# Altium schematic sheet 07 flash.SchDoc
size A3; SheetNumber: 11; SheetTotal: 16
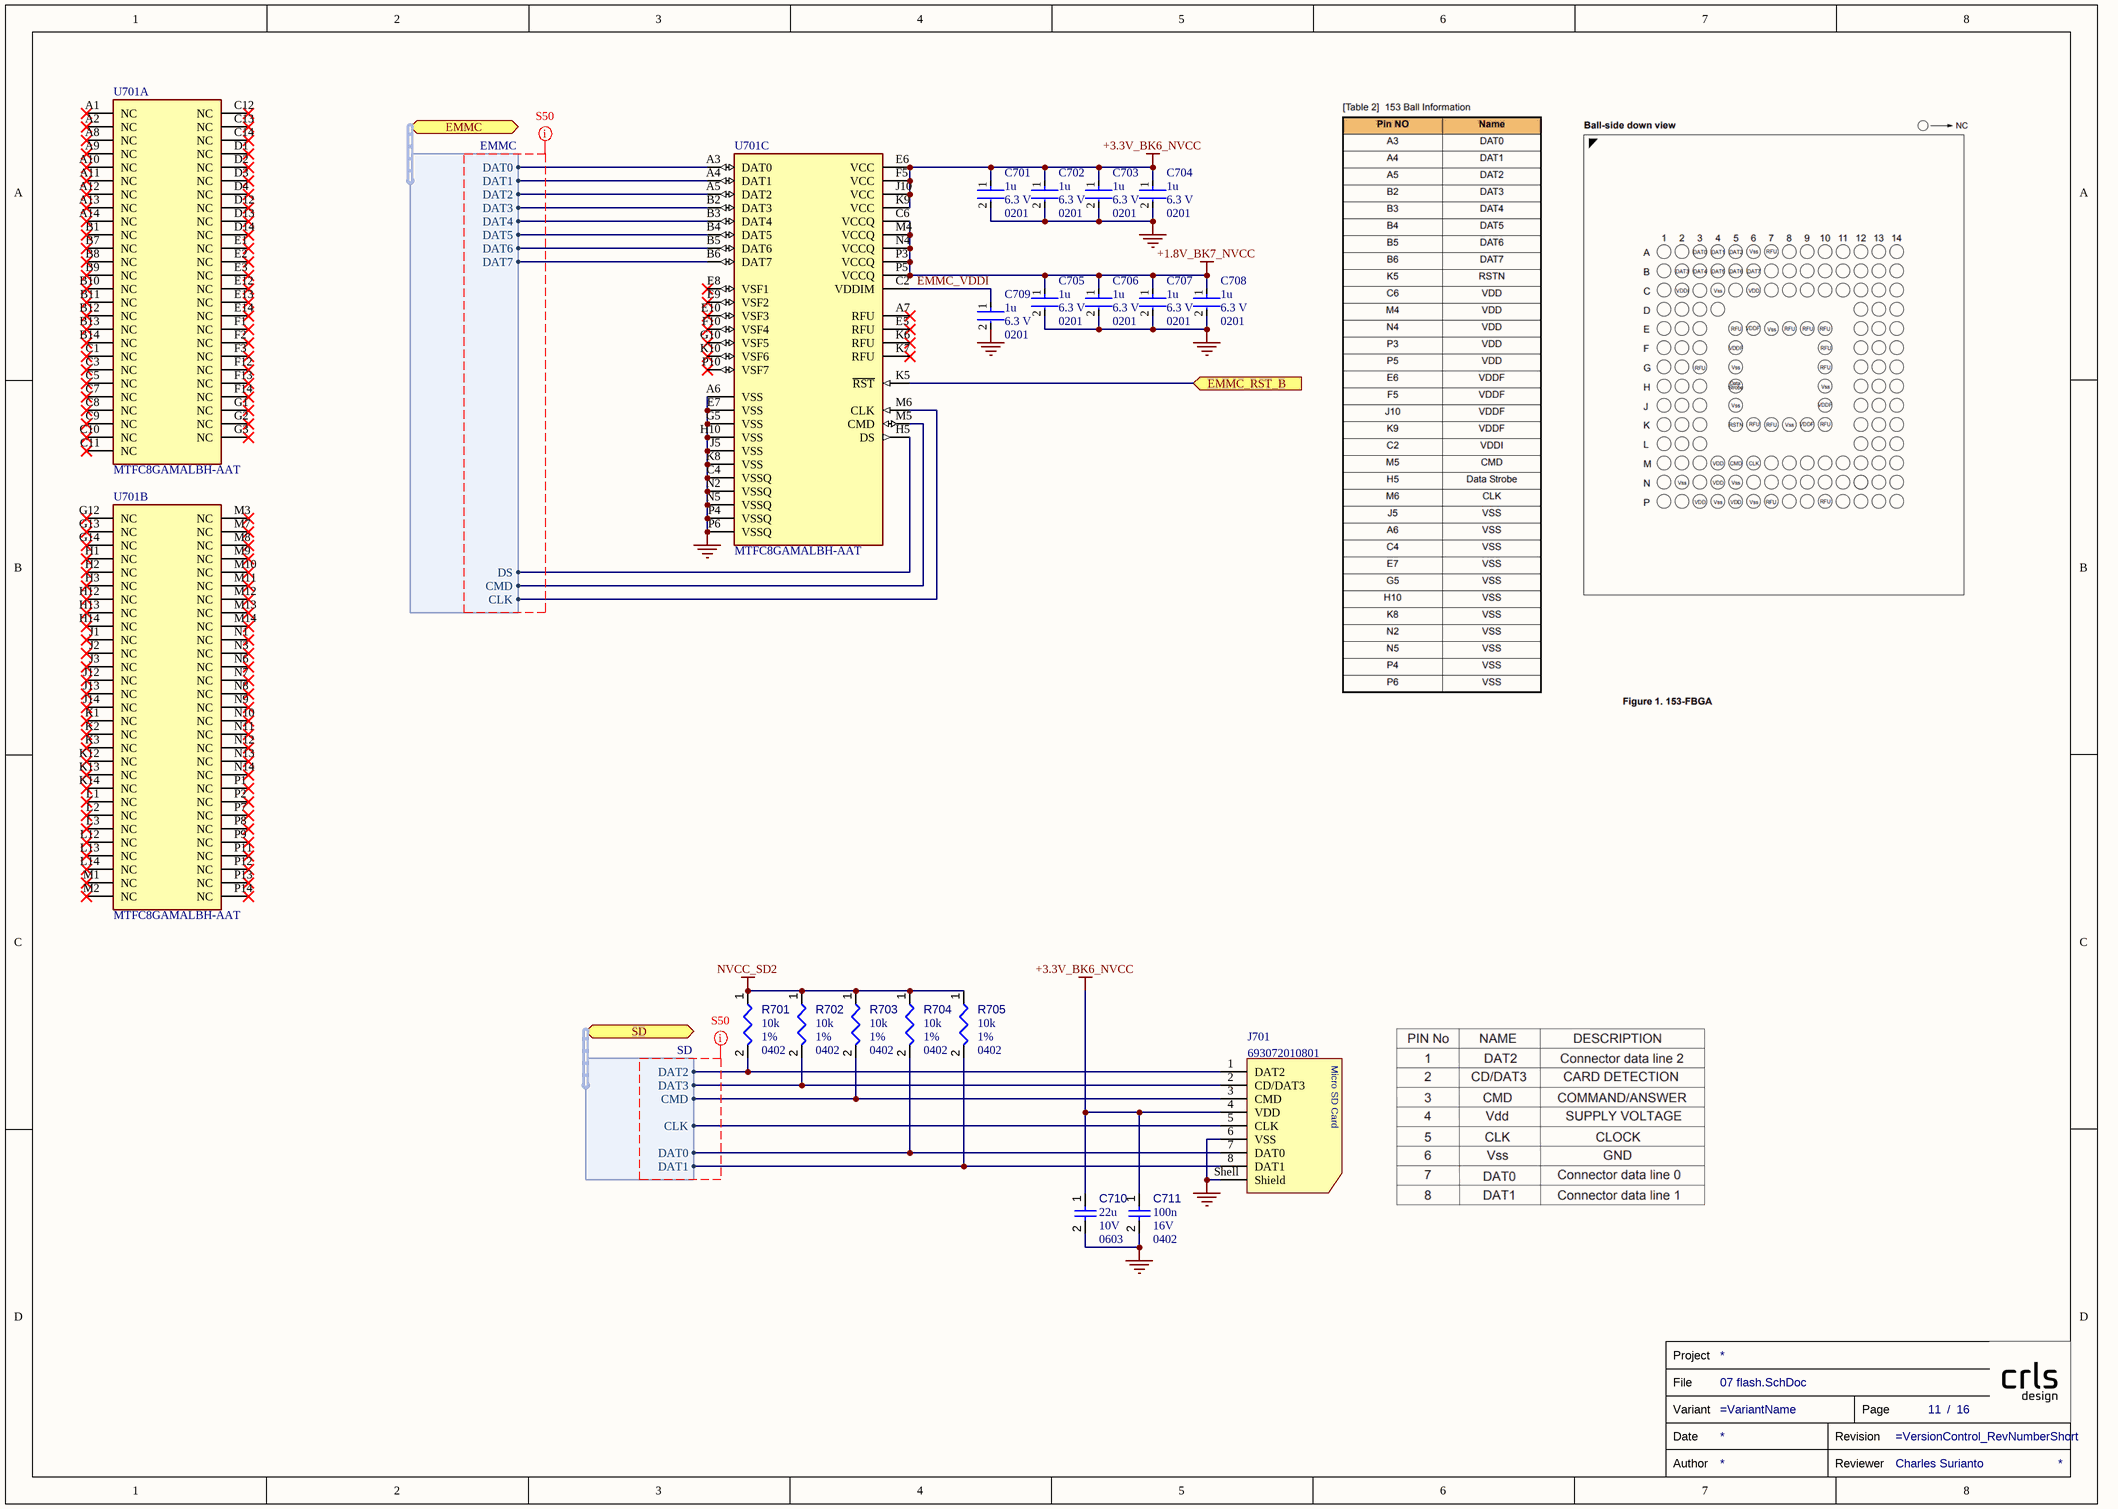
[diagram p0: 07 flash.SchDoc]

## Parts
C701  Package: 0201  Capacitance: 1u  Voltage Rating: 6.3 V  [FP-CC0201-BA-MFG]  (hidden comment: CC0201MRX5R5BB105)
C702  Package: 0201  Capacitance: 1u  Voltage Rating: 6.3 V  [FP-CC0201-BA-MFG]  (hidden comment: CC0201MRX5R5BB105)
C703  Package: 0201  Capacitance: 1u  Voltage Rating: 6.3 V  [FP-CC0201-BA-MFG]  (hidden comment: CC0201MRX5R5BB105)
C704  Package: 0201  Capacitance: 1u  Voltage Rating: 6.3 V  [FP-CC0201-BA-MFG]  (hidden comment: CC0201MRX5R5BB105)
C705  Package: 0201  Capacitance: 1u  Voltage Rating: 6.3 V  [FP-CC0201-BA-MFG]  (hidden comment: CC0201MRX5R5BB105)
C706  Package: 0201  Capacitance: 1u  Voltage Rating: 6.3 V  [FP-CC0201-BA-MFG]  (hidden comment: CC0201MRX5R5BB105)
C707  Package: 0201  Capacitance: 1u  Voltage Rating: 6.3 V  [FP-CC0201-BA-MFG]  (hidden comment: CC0201MRX5R5BB105)
C708  Package: 0201  Capacitance: 1u  Voltage Rating: 6.3 V  [FP-CC0201-BA-MFG]  (hidden comment: CC0201MRX5R5BB105)
C709  Package: 0201  Capacitance: 1u  Voltage Rating: 6.3 V  [FP-CC0201-BA-MFG]  (hidden comment: CC0201MRX5R5BB105)
C710  value 22u  Case/Package: 0603  Voltage Rating: 10V  [CAPC0603(1608)100_L]  (hidden comment: Capacitors,0603,22u,10V)
C711  value 100n  Case/Package: 0402  Voltage Rating: 16V  [CAPC0402(1005)60_L]  (hidden comment: Capacitors,0402,100n,16V)
J701  693072010801  [693072010801]
R701  value 10k  Case/Package: 0402  Tolerance: 1%  [RESC0402(1005)_L]  (hidden comment: Resistors,0402,1%,10k)
R702  value 10k  Case/Package: 0402  Tolerance: 1%  [RESC0402(1005)_L]  (hidden comment: Resistors,0402,1%,10k)
R703  value 10k  Case/Package: 0402  Tolerance: 1%  [RESC0402(1005)_L]  (hidden comment: Resistors,0402,1%,10k)
R704  value 10k  Case/Package: 0402  Tolerance: 1%  [RESC0402(1005)_L]  (hidden comment: Resistors,0402,1%,10k)
R705  value 10k  Case/Package: 0402  Tolerance: 1%  [RESC0402(1005)_L]  (hidden comment: Resistors,0402,1%,10k)
TB?  Reviewer: Charles Surianto  (hidden comment: TITLE_BLOCK)  (graphical)
U701  MTFC8GAMALBH-AAT  [FP-BH-MFG]  (parts A,B,C of 3)

## Ports
EMMC (bidir, harness EMMC), EMMC_RST_B (in), SD (bidir, harness SD)

## Harnesses
SD: DAT2, DAT3, CMD, DAT1, DAT0, CLK
EMMC: DAT1, DAT3, DAT2, DAT4, DAT0, DAT5, DAT6, DAT7, DS, CMD, CLK

## Nets
+1.8V_BK7_NVCC: C705.1 C706.1 C707.1 C708.1 U701.C6(VCCQ) U701.M4(VCCQ) U701.N4(VCCQ) U701.P3(VCCQ) U701.P5(VCCQ)
+3.3V_BK6_NVCC: C701.1 C702.1 C703.1 C704.1 C710.1 C711.1 J701.4(VDD) U701.E6(VCC) U701.F5(VCC) U701.J10(VCC) U701.K9(VCC)
GND: C701.2 C702.2 C703.2 C704.2 C705.2 C706.2 C707.2 C708.2 C709.2 C710.2 C711.2 J701.6(VSS) J701.Shell(Shield) U701.A6(VSS) U701.C4(VSSQ) U701.E7(VSS) U701.G5(VSS) U701.H10(VSS) U701.J5(VSS) U701.K8(VSS) U701.N2(VSSQ) U701.N5(VSSQ) U701.P4(VSSQ) U701.P6(VSSQ)
NVCC_SD2: R701.1 R702.1 R703.1 R704.1 R705.1
EMMC_RST_B: U701.K5(~{RST}) ; port EMMC_RST_B
EMMC_VDDI: C709.1 U701.C2(VDDIM)
NetJ701_1: J701.1(DAT2) R701.2 ; port SD.DAT2
NetJ701_2: J701.2(CD/DAT3) R702.2 ; port SD.DAT3
NetJ701_3: J701.3(CMD) R703.2 ; port SD.CMD
NetJ701_5: J701.5(CLK) ; port SD.CLK
NetJ701_7: J701.7(DAT0) R704.2 ; port SD.DAT0
NetJ701_8: J701.8(DAT1) R705.2 ; port SD.DAT1
NetU701_A3: U701.A3(DAT0) ; port EMMC.DAT0
NetU701_A4: U701.A4(DAT1) ; port EMMC.DAT1
NetU701_A5: U701.A5(DAT2) ; port EMMC.DAT2
NetU701_B2: U701.B2(DAT3) ; port EMMC.DAT3
NetU701_B3: U701.B3(DAT4) ; port EMMC.DAT4
NetU701_B4: U701.B4(DAT5) ; port EMMC.DAT5
NetU701_B5: U701.B5(DAT6) ; port EMMC.DAT6
NetU701_B6: U701.B6(DAT7) ; port EMMC.DAT7
NetU701_H5: U701.H5(DS) ; port EMMC.DS
NetU701_M5: U701.M5(CMD) ; port EMMC.CMD
NetU701_M6: U701.M6(CLK) ; port EMMC.CLK

Not connected (* = marked no-connect by the designer): U701 A1(NC)* A2(NC)* A7(RFU)* A8(NC)* A9(NC)* A10(NC)* A11(NC)* A12(NC)* A13(NC)* A14(NC)* B1(NC)* B7(NC)* B8(NC)* B9(NC)* B10(NC)* B11(NC)* B12(NC)* B13(NC)* B14(NC)* C1(NC)* C3(NC)* C5(NC)* C7(NC)* C8(NC)* C9(NC)* C10(NC)* C11(NC)* C12(NC)* C13(NC)* C14(NC)* D1(NC)* D2(NC)* D3(NC)* D4(NC)* D12(NC)* D13(NC)* D14(NC)* E1(NC)* E2(NC)* E3(NC)* E5(RFU)* E8(VSF1)* E9(VSF2)* E10(VSF3)* E12(NC)* E13(NC)* E14(NC)* F1(NC)* F2(NC)* F3(NC)* F10(VSF4)* F12(NC)* F13(NC)* F14(NC)* G1(NC)* G2(NC)* G3(NC)* G10(VSF5)* G12(NC)* G13(NC)* G14(NC)* H1(NC)* H2(NC)* H3(NC)* H12(NC)* H13(NC)* H14(NC)* J1(NC)* J2(NC)* J3(NC)* J12(NC)* J13(NC)* J14(NC)* K1(NC)* K2(NC)* K3(NC)* K6(RFU)* K7(RFU)* K10(VSF6)* K12(NC)* K13(NC)* K14(NC)* L1(NC)* L2(NC)* L3(NC)* L12(NC)* L13(NC)* L14(NC)* M1(NC)* M2(NC)* M3(NC)* M7(NC)* M8(NC)* M9(NC)* M10(NC)* M11(NC)* M12(NC)* M13(NC)* M14(NC)* N1(NC)* N3(NC)* N6(NC)* N7(NC)* N8(NC)* N9(NC)* N10(NC)* N11(NC)* N12(NC)* N13(NC)* N14(NC)* P1(NC)* P2(NC)* P7(NC)* P8(NC)* P9(NC)* P10(VSF7)* P11(NC)* P12(NC)* P13(NC)* P14(NC)*

## Layout directives
net class S50: (no net found under the mark)

## Notes on the sheet
- (in symbol CMP-1502-00164-3) Micro SD Card
- (in symbol TITLE_BLOCK) Project; File; Variant; Page; /; Date; Revision; Author; Reviewer

## Library data of the parts
C701-C709 = CMP-03422-000660-2: CAP CER 1UF 6.3V X5R 0201; Manufacturer: Yageo; Tolerance: 0.2; Material: Ceramic; Temperature Coefficient: 15%; Category: Cap; Digikey Description: CAP CER 1UF 6.3V X5R 0201; Temperature: -55°C to +85°C; Temperature Range High: +85°C; ComponentLink2Description: Datasheet; Lead Free: Yes; Height: 0.33mm; Temperature Range Low: -55°C; Temperature Characteristic: X5R; Device Class L1: Passive Components; Footprint Url: http://www.yageo.com/exep/pages/download/literatures/UPY-C_GEN_24.pdf; Value: 1 uF; Octopart: https://octopart.com/cc0201mrx5r5bb105-yageo-33242268; Manufacturer Part Number: CC0201MRX5R5BB105; Automotive: No; Mouser Description: Multilayer Ceramic Capacitors MLCC - SMD/SMT 1.0uF 6.3V X5R 20%; Device Class L3: Ceramic Capacitors; ComponentLink2URL: http://www.yageo.com/documents/recent/UPY-GPHC_X5R_4V-to-50V_25.pdf; RoHS: TRUE; Ipc Land Pattern Name: CAPC6030X30; Device Class L2: Capacitors
C710 C711 = Capacitors: Capacitor; Component Type: Capacitors
J701 = CMP-1502-00164-3: Conn, Memory Skt, Microsd, 8POS, Hinged Rohs Compliant: Yes; Insulation Resistance: 1GΩ; Connector Type: Connector; Memory Type: FLASH; Number of Contacts: 8; Voltage Rating: 100V; Current Rating: 500mA; Contact Material: Gold; Min Operating Temperature: -25°C; Number of Pins: 8; Contact Plating: Gold; REACH SVHC: Unknown; RoHS: Compliant; Color: Black; Number of Positions: 8; Mount: Surface Mount; Length: 14.5mm; Height: 1.95mm; Packaging: Tape and Reel; Max Operating Temperature: 85°C; Width: 13.5mm; Operating Supply Voltage: 100V
R701-R705 = Resistors: Resistor; Component Type: Resistors
U701 = CMP-14955-000001-1: IC FLASH 64GBIT MMC 153TFBGA; Memory Type: Non-Volatile; Memory Size: 64Gb; Max Operating Temperature: 105°C; Min Operating Temperature: -40°C
TB? = TITLE_BLOCK: Review Date: *